# Altium schematic sheet COMS0007 ModemRXMux.SchDoc: BLUEsat Switching Circuit
size A3; Engineer: D. JEDRYCHOWSKI; Organization: BLUEsat Project; Address1: Room 419; Address2: School of EE&T; Address3: UNSW, NSW 2052; Address4: Australia; DocumentNumber: COMS0007; SheetNumber: 4; SheetTotal: 4; Description: Selects the GMSK and AFSK modems to be used for reception; Version: 1.0
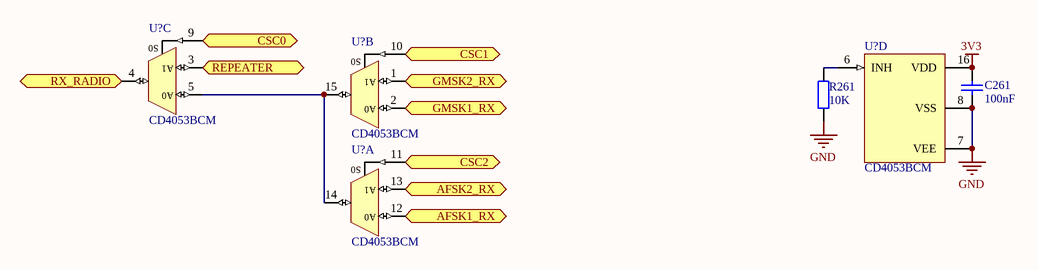
[diagram p0: COMS0007 ModemRXMux.SchDoc]

## Parts
(Parts that share a designator on the sheet are numbered #1, #2 ... from top to bottom, then left to right.)
C261  value 100nF  [CAP0603]  (hidden comment: Capacitor, ceramic)
R261  value 10K  [RES0603]  (hidden comment: Res1)
U?#1  CD4053BCM  [TSSOP16]  (part C of 4)
U?#2  CD4053BCM  [TSSOP16]  (part B of 4)
U?#3  CD4053BCM  [TSSOP16]  (part D of 4)
U?#4  CD4053BCM  [TSSOP16]  (part A of 4)

## Ports
AFSK1_RX (out), AFSK2_RX (out), CSC0 (in), CSC1 (in), CSC2 (in), GMSK1_RX (out), GMSK2_RX (out), REPEATER (out), RX_RADIO (in)

## Nets
3V3: C261.2 U?#3.16(VDD)
GND: C261.1 R261.1 U?#3.7(VEE) U?#3.8(VSS)
AFSK1_RX: U?#4.12(A0) ; port AFSK1_RX
AFSK2_RX: U?#4.13(A1) ; port AFSK2_RX
CSC0: U?#1.9(C) ; port CSC0
CSC1: U?#2.10(B) ; port CSC1
CSC2: U?#4.11(A) ; port CSC2
GMSK1_RX: U?#2.2(bx) ; port GMSK1_RX
GMSK2_RX: U?#2.1(by) ; port GMSK2_RX
REPEATER: U?#1.3(cy) ; port REPEATER
RX_RADIO: U?#1.4(c_out) ; port RX_RADIO
NetR261_2: R261.2 U?#3.6(INH)
NetU?#1_5: U?#1.5(cx) U?#2.15(b_out) U?#4.14(A_out)

## Notes on the sheet
- Title
- Description:
- Size:
- Author:
- Date:
- A3
- Time:
- Version
- Sheet:
- Drawing No.:
- of
- File:
- (in symbol CD4053BCM, part A) S0
- (in symbol CD4053BCM, part B) S0
- (in symbol CD4053BCM, part C) S0

## Library data of the parts
C261 = CAP0603: Capacitor; Supplier 1: Farnell; Supplier Product Range Link: http://au.element14.com/jsp/level5/module.jsp?moduleId=en/208437.xml
R261 = RES0603: Resistor; Supplier: Farnell; Supplier Order Number: *
U?#1-U?#4 = CD4053BCM: Triple 2-Channnel Analog Multiplexer/Demutiplexer; Supplier 1: Farnell; Supplier Part Number 1: 2132284